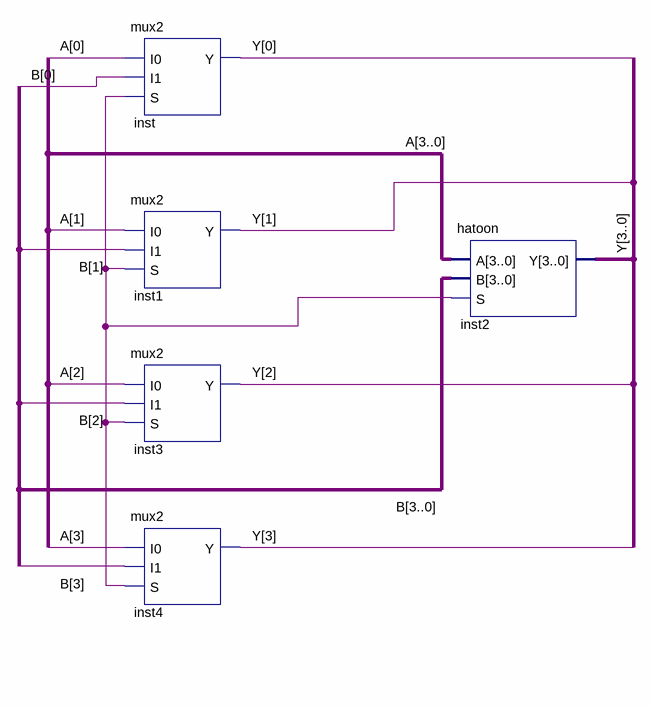
[diagram p0: schematic sheet]
// Quartus schematic Quad4block.bdf as structural Verilog: 5 symbols, 0 pins
module Quad4block (
);

  wire undriven;
  wire [3:0] A, B, Y;

  mux2 inst (.I0(A[0]), .I1(B[0]), .S(undriven), .Y(Y[0]));
  mux2 inst1 (.I0(A[1]), .I1(B[1]), .S(undriven), .Y(Y[1]));
  mux2 inst3 (.I0(A[2]), .I1(B[2]), .S(undriven), .Y(Y[2]));
  mux2 inst4 (.I0(A[3]), .I1(B[3]), .S(undriven), .Y(Y[3]));
  hatoon inst2 (.A(A), .B(B), .S(undriven), .Y(Y));
endmodule
